# Altium schematic sheet breeze_controller.SchDoc: Breeze Quadcopter
size A4; Author: myyerrol; Organization: Team MicroDynamics; Address1: NWPU; Address2: Xi'an; Address3: Shannxi; Address4: China; Revision: V0.1; SheetNumber: 1; SheetTotal: 5
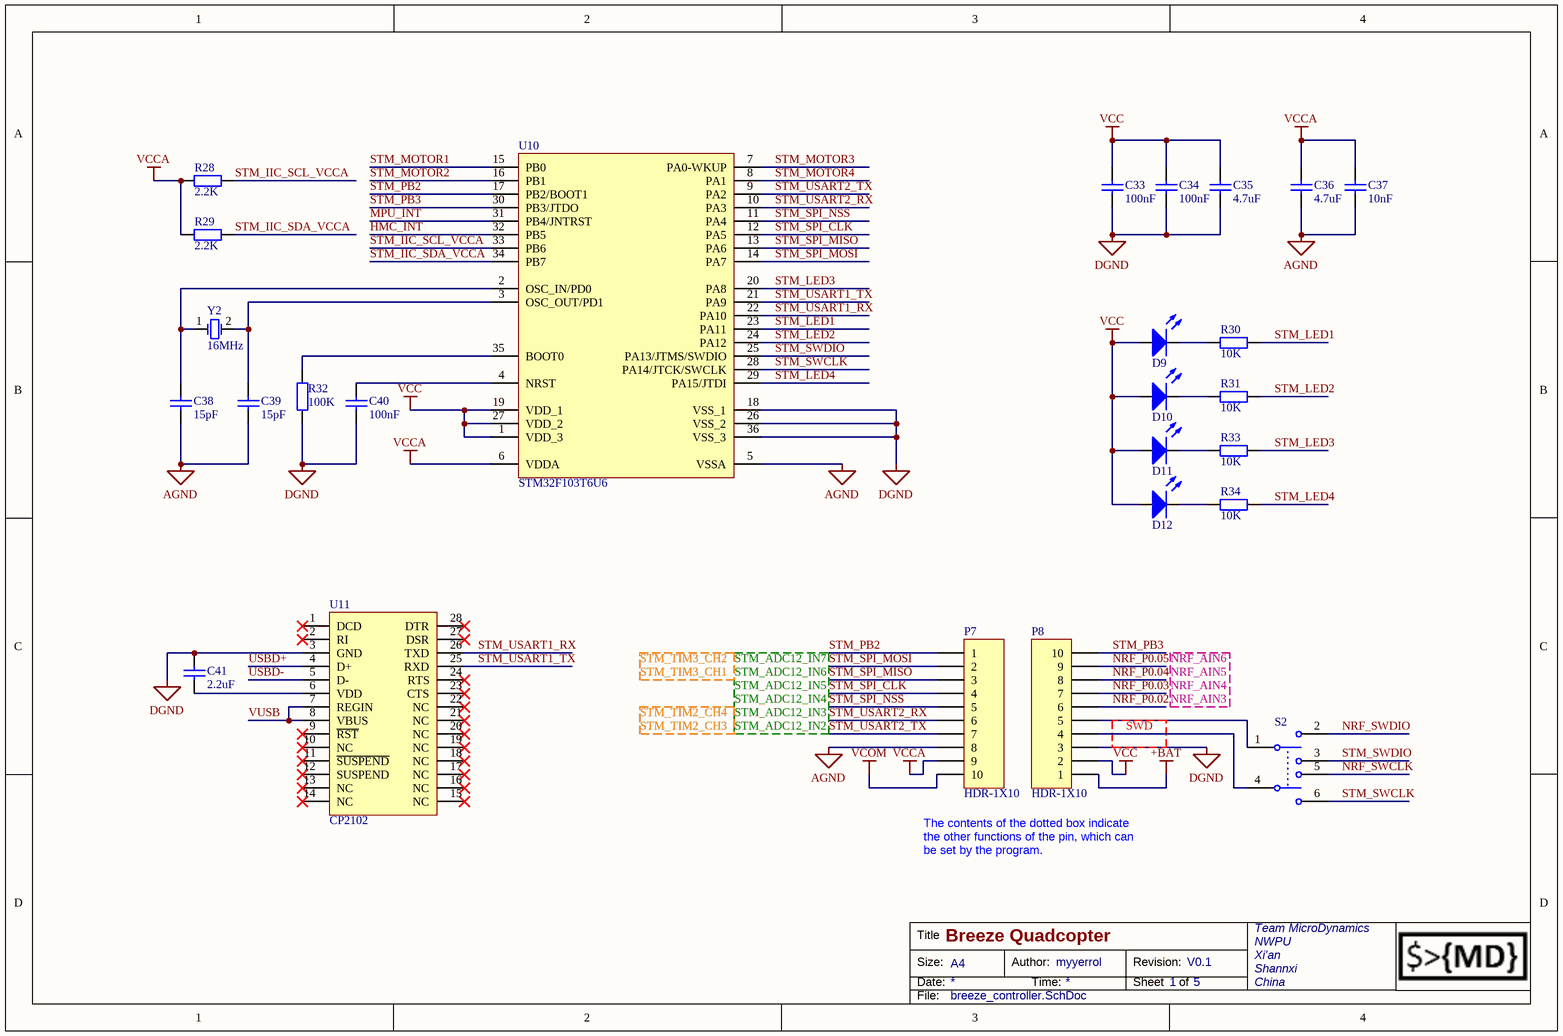
[diagram p0: breeze_controller.SchDoc]

## Parts
C33  value 100nF  [SMD-0603]  (hidden comment: CAP-0603)
C34  value 100nF  [SMD-0603]  (hidden comment: CAP-0603)
C35  value 4.7uF  [SMD-0603]  (hidden comment: CAP-0603)
C36  value 4.7uF  [SMD-0603]  (hidden comment: CAP-0603)
C37  value 10nF  [SMD-0603]  (hidden comment: CAP-0603)
C38  value 15pF  [SMD-0603]  (hidden comment: CAP-0603)
C39  value 15pF  [SMD-0603]  (hidden comment: CAP-0603)
C40  value 100nF  [SMD-0603]  (hidden comment: CAP-0603)
C41  value 2.2uF  [SMD-0603]  (hidden comment: CAP-0603)
D9  LED-0603  [SMD-0603]  (value not drawn)
D10  LED-0603  [SMD-0603]  (value not drawn)
D11  LED-0603  [SMD-0603]  (value not drawn)
D12  LED-0603  [SMD-0603]  (value not drawn)
P7  HDR-1X10  [HDR-1X10]
P8  HDR-1X10  [HDR-1X10]
R28  value 2.2K  [SMD-0603]  (hidden comment: RES-0603)
R29  value 2.2K  [SMD-0603]  (hidden comment: RES-0603)
R30  value 10K  [SMD-0603]  (hidden comment: RES-0603)
R31  value 10K  [SMD-0603]  (hidden comment: RES-0603)
R32  value 100K  [SMD-0603]  (hidden comment: RES-0603)
R33  value 10K  [SMD-0603]  (hidden comment: RES-0603)
R34  value 10K  [SMD-0603]  (hidden comment: RES-0603)
S2  MSS-22D18G2  [MSS-22D18G2]  (value not drawn)
U10  STM32F103T6U6  [VFQFPN-36]
U11  CP2102  [QFN-28]
Y2  value 16MHz  [SMD-5032]  (hidden comment: XTAL-5032)

## Nets
+BAT: P8.1
AGND: C36.2 C37.2 C38.2 C39.2 P7.8 U10.5(VSSA)
DGND: C33.2 C34.2 C35.2 C40.2 C41.2 P8.3 R32.2 U10.18(VSS_1) U10.26(VSS_2) U10.36(VSS_3) U11.3(GND)
VCC: C33.1 C34.1 C35.1 D9.1(A) D10.1(A) D11.1(A) D12.1(A) P8.2 U10.1(VDD_3) U10.19(VDD_1) U10.27(VDD_2)
VCCA: C36.1 C37.1 P7.9 R28.1 R29.1 U10.6(VDDA)
VCOM: P7.10
HMC_INT: U10.32(PB5)
MPU_INT: U10.31(PB4/JNTRST)
NRF_P0.02: P8.6
NRF_P0.03: P8.7
NRF_P0.04: P8.8
NRF_P0.05: P8.9
NRF_SWCLK: S2.5
NRF_SWDIO: S2.2
STM_IIC_SCL_VCCA: R28.2 U10.33(PB6)
STM_IIC_SDA_VCCA: R29.2 U10.34(PB7)
STM_LED1: R30.2 U10.23(PA11)
STM_LED2: R31.2 U10.24(PA12)
STM_LED3: R33.2 U10.20(PA8)
STM_LED4: R34.2 U10.29(PA15/JTDI)
STM_MOTOR1: U10.15(PB0)
STM_MOTOR2: U10.16(PB1)
STM_MOTOR3: U10.7(PA0-WKUP)
STM_MOTOR4: U10.8(PA1)
STM_PB2: P7.1 U10.17(PB2/BOOT1)
STM_PB3: P8.10 U10.30(PB3/JTDO)
STM_SPI_CLK: P7.4 U10.12(PA5)
STM_SPI_MISO: P7.3 U10.13(PA6)
STM_SPI_MOSI: P7.2 U10.14(PA7)
STM_SPI_NSS: P7.5 U10.11(PA4)
STM_SWCLK: S2.6 U10.28(PA14/JTCK/SWCLK)
STM_SWDIO: S2.3 U10.25(PA13/JTMS/SWDIO)
STM_USART1_RX: U10.22(PA10) U11.26(TXD)
STM_USART1_TX: U10.21(PA9) U11.25(RXD)
STM_USART2_RX: P7.6 U10.10(PA3)
STM_USART2_TX: P7.7 U10.9(PA2)
USBD+: U11.4(D+)
USBD-: U11.5(D-)
VUSB: U11.7(REGIN) U11.8(VBUS)
NetC38_1: C38.1 U10.2(OSC_IN/PD0) Y2.1(OSC1)
NetC39_1: C39.1 U10.3(OSC_OUT/PD1) Y2.2(OSC2)
NetC40_1: C40.1 U10.4(NRST)
NetC41_1: C41.1 U11.6(VDD)
NetD9_2: D9.2(K) R30.1
NetD10_2: D10.2(K) R31.1
NetD11_2: D11.2(K) R33.1
NetD12_2: D12.2(K) R34.1
NetP8_4: P8.4 S2.4
NetP8_5: P8.5 S2.1
NetR32_1: R32.1 U10.35(BOOT0)

Not connected (* = marked no-connect by the designer): U11 1(DCD)* 2(RI)* 9(~{RST})* 10(NC)* 11(~{SUSPEND})* 12(SUSPEND)* 13(NC)* 14(NC)* 15(NC)* 16(NC)* 17(NC)* 18(NC)* 19(NC)* 20(NC)* 21(NC)* 22(NC)* 23(CTS)* 24(RTS)* 27(DSR)* 28(DTR)*

## Notes on the sheet
- STM_TIM3_CH2
- STM_TIM3_CH1
- STM_TIM2_CH4
- STM_ADC12_IN6
- STM_ADC12_IN5
- STM_ADC12_IN4
- STM_ADC12_IN3
- STM_ADC12_IN7
- NRF_AIN6
- NRF_AIN5
- NRF_AIN4
- NRF_AIN3
- STM_TIM2_CH3
- STM_ADC12_IN2
- SWD
- The contents of the dotted box indicate the other functions of the pin, which can be set by the program.
- Title
- Size:
- Date:
- A4
- Author:
- Time:
- Revision:
- Sheet
- of
- File:

## Library data of the parts
C33-C41 = CAP-0603: Capacitor
D9-D12 = LED-0603: LED
P7 P8 = HDR-1X10: Header 1X10
R28-R34 = RES-0603: Resistor
S2 = MSS-22D18G2: Double-Pole, Double-Throw Switch
U10 = STM32F103T6U6: ARM Cortex-M3 MCU
U11 = CP2102: Highly-integrated USB-to-UART Bridge Controller
Y2 = XTAL-5032: Passive Crystal Oscillator